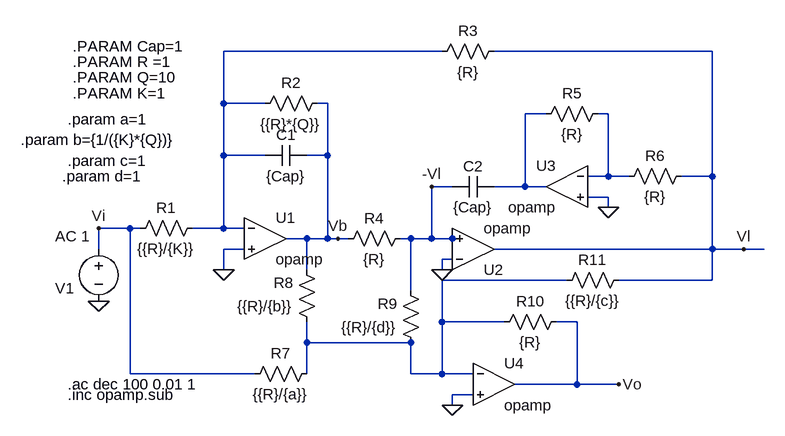
[diagram p0: schematic bicuad.asc]
bicuad.asc, the LTspice schematic file:
Version 4
SHEET 1 1220 680
WIRE 592 -96 256 -96
WIRE 1008 -96 672 -96
WIRE 256 -16 256 -96
WIRE 320 -16 256 -16
WIRE 416 -16 400 -16
WIRE 752 0 720 0
WIRE 848 0 832 0
WIRE 256 64 256 -16
WIRE 320 64 256 64
WIRE 416 64 416 -16
WIRE 416 64 384 64
WIRE 848 96 848 0
WIRE 848 96 816 96
WIRE 880 96 848 96
WIRE 1008 96 1008 -96
WIRE 1008 96 960 96
WIRE 608 112 576 112
WIRE 720 112 720 0
WIRE 720 112 672 112
WIRE 752 112 720 112
WIRE 848 128 816 128
WIRE 848 144 848 128
WIRE 112 176 64 176
WIRE 128 176 112 176
WIRE 256 176 256 64
WIRE 256 176 208 176
WIRE 288 176 256 176
WIRE 384 192 352 192
WIRE 416 192 416 64
WIRE 416 192 384 192
WIRE 432 192 416 192
WIRE 448 192 432 192
WIRE 544 192 528 192
WIRE 576 192 576 112
WIRE 576 192 544 192
WIRE 608 192 576 192
WIRE 624 192 608 192
WIRE 64 208 64 176
WIRE 288 208 256 208
WIRE 1008 208 1008 96
WIRE 1008 208 672 208
WIRE 1056 208 1008 208
WIRE 1088 208 1056 208
WIRE 608 224 592 224
WIRE 256 240 256 208
WIRE 384 240 384 192
WIRE 592 240 592 224
WIRE 784 256 592 256
WIRE 1008 256 1008 208
WIRE 1008 256 864 256
WIRE 544 272 544 192
WIRE 592 320 592 256
WIRE 688 320 592 320
WIRE 800 320 768 320
WIRE 384 352 384 320
WIRE 544 352 384 352
WIRE 112 400 112 176
WIRE 304 400 112 400
WIRE 384 400 384 352
WIRE 544 400 544 352
WIRE 592 400 592 320
WIRE 592 400 544 400
WIRE 640 400 592 400
WIRE 800 416 800 320
WIRE 800 416 704 416
WIRE 864 416 800 416
WIRE 640 432 608 432
WIRE 608 448 608 432
FLAG 592 240 0
FLAG 848 144 0
FLAG 64 288 0
FLAG 256 240 0
FLAG 864 416 Vo
FLAG 64 176 Vi
FLAG 608 448 0
FLAG 1056 208 Vl
FLAG 576 112 -Vl
FLAG 432 192 Vb
SYMBOL res 224 160 R90
WINDOW 0 0 56 VBottom 2
WINDOW 3 32 56 VTop 2
SYMATTR InstName R1
SYMATTR Value {{R}/{K}}
SYMBOL res 416 -32 R90
WINDOW 0 0 56 VBottom 2
WINDOW 3 32 56 VTop 2
SYMATTR InstName R2
SYMATTR Value {{R}*{Q}}
SYMBOL res 688 -112 R90
WINDOW 0 0 56 VBottom 2
WINDOW 3 32 56 VTop 2
SYMATTR InstName R3
SYMATTR Value {R}
SYMBOL res 544 176 R90
WINDOW 0 0 56 VBottom 2
WINDOW 3 32 56 VTop 2
SYMATTR InstName R4
SYMATTR Value {R}
SYMBOL res 848 -16 R90
WINDOW 0 0 56 VBottom 2
WINDOW 3 32 56 VTop 2
SYMATTR InstName R5
SYMATTR Value {R}
SYMBOL res 976 80 R90
WINDOW 0 0 56 VBottom 2
WINDOW 3 32 56 VTop 2
SYMATTR InstName R6
SYMATTR Value {R}
SYMBOL OpAmps\\opamp 320 128 R0
SYMATTR InstName U1
SYMBOL OpAmps\\opamp 640 272 M180
SYMATTR InstName U2
SYMBOL OpAmps\\opamp 784 48 M0
SYMATTR InstName U3
SYMBOL cap 384 48 R90
WINDOW 0 0 32 VBottom 2
WINDOW 3 32 32 VTop 2
SYMATTR InstName C1
SYMATTR Value {Cap}
SYMBOL cap 672 96 R90
WINDOW 0 0 32 VBottom 2
WINDOW 3 32 32 VTop 2
SYMATTR InstName C2
SYMATTR Value {Cap}
SYMBOL voltage 64 192 R0
WINDOW 123 -67 -4 Left 2
WINDOW 39 0 0 Left 0
WINDOW 0 -67 76 Left 2
SYMATTR Value2 AC 1
SYMATTR InstName V1
SYMATTR Value ""
SYMBOL OpAmps\\opamp 672 352 R0
SYMATTR InstName U4
SYMBOL res 400 384 R90
WINDOW 0 0 56 VBottom 2
WINDOW 3 32 56 VTop 2
SYMATTR InstName R7
SYMATTR Value {{R}/{a}}
SYMBOL res 400 336 R180
WINDOW 0 36 76 Left 2
WINDOW 3 36 40 Left 2
SYMATTR InstName R8
SYMATTR Value {{R}/{b}}
SYMBOL res 560 368 R180
WINDOW 0 36 76 Left 2
WINDOW 3 36 40 Left 2
SYMATTR InstName R9
SYMATTR Value {{R}/{d}}
SYMBOL res 672 336 R270
WINDOW 0 32 56 VTop 2
WINDOW 3 0 56 VBottom 2
SYMATTR InstName R10
SYMATTR Value {R}
SYMBOL res 880 240 R90
WINDOW 0 0 56 VBottom 2
WINDOW 3 32 56 VTop 2
SYMATTR InstName R11
SYMATTR Value {{R}/{c}}
TEXT 24 -80 Left 2 !.PARAM R =1
TEXT 24 -56 Left 2 !.PARAM Q=10
TEXT 16 416 Left 2 !.ac dec 100 0.01 1
TEXT 16 432 Left 2 !.inc opamp.sub
TEXT 16 72 Left 2 !.param c=1
TEXT 16 8 Left 2 !.param a=1
TEXT -56 40 Left 2 !.param b={1/({K}*{Q})}
TEXT 8 96 Left 2 !.param d=1
TEXT 24 -104 Left 2 !.PARAM Cap=1
TEXT 24 -32 Left 2 !.PARAM K=1

The netlist it stands for:
* bicuad.asc
R1 N001 Vi {{R}/{K}}
R2 Vb N001 {{R}*{Q}}
R3 Vl N001 {R}
R4 -Vl Vb {R}
R5 N003 N002 {R}
R6 Vl N003 {R}
XU1 N001 0 Vb opamp Aol=100K GBW=10Meg  ; pins invin noninvin out
XU2 0 -Vl Vl opamp Aol=100K GBW=10Meg  ; pins invin noninvin out
XU3 N003 0 N002 opamp Aol=100K GBW=10Meg  ; pins invin noninvin out
C1 Vb N001 {Cap}
C2 N002 -Vl {Cap}
V1 Vi 0 AC 1
XU4 N004 0 Vo opamp Aol=100K GBW=10Meg  ; pins invin noninvin out
R7 N004 Vi {{R}/{a}}
R8 N004 Vb {{R}/{b}}
R9 N004 -Vl {{R}/{d}}
R10 N004 Vo {R}
R11 Vl N004 {{R}/{c}}
.PARAM R =1
.PARAM Q=10
.ac dec 100 0.01 1
.inc opamp.sub
.param c=1
.param a=1
.param b={1/({K}*{Q})}
.param d=1
.PARAM Cap=1
.PARAM K=1
.backanno
.end